# EAGLE design Detectors (EAGLE 9.4.2)
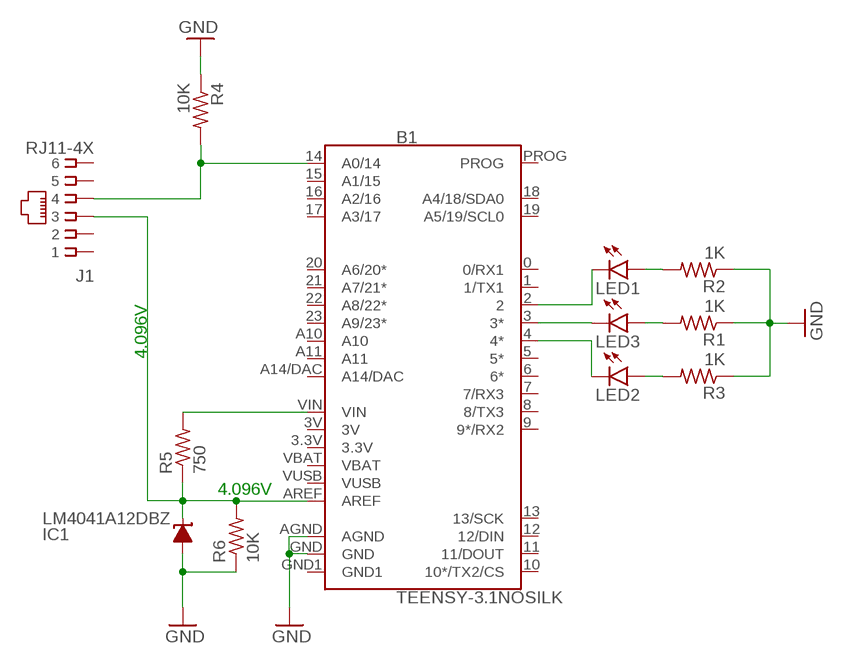
[diagram p0: schematic, sheet 1]

## Parts
B1  TEENSY-3.1NOSILK  [TEENSY-3.1_NOSILK]
IC1  LM4041A12DBZ  [DBZ_R-PDSO-G3]
J1  RJ11-4X  [RJ11-NO_SHIELD]
LED1  LED5MM  [LED5MM]
LED2  LED5MM  [LED5MM]
LED3  LED5MM  [LED5MM]
R1  1K  R-US_R0805  [R0805]
R2  1K  R-US_R0805  [R0805]
R3  1K  R-US_R0805  [R0805]
R4  10K  R-US_R0805  [R0805]
R5  750  R-US_R0805  [R0805]
R6  10K  R-US_R0805  [R0805]

## Nets
GND: B1.AGND B1.GND IC1.2(A) R1.1 R2.1 R3.1 R4.1 R6.1
N$1: B1.AREF IC1.1(C) J1.3 R5.1 R6.2
N$2: LED2.A R3.2
N$3: LED3.A R1.2
N$4: LED1.A R2.2
N$5: B1.2 LED1.K(C)
N$6: B1.3(3*) LED3.K(C)
N$7: B1.4(4*) LED2.K(C)
N$8: B1.VIN R5.2
N$9: B1.14(A0/14) J1.4 R4.2
Unconnected: B1.0(0/RX1) B1.1(1/TX1) B1.5(5*) B1.6(6*) B1.7(7/RX3) B1.8(8/TX3) B1.9(9*/RX2) B1.10(10*/TX2/CS) B1.11(11/DOUT) B1.12(12/DIN) B1.13(13/SCK) B1.15(A1/15) B1.16(A2/16) B1.17(A3/17) B1.18(A4/18/SDA0) B1.19(A5/19/SCL0) B1.20(A6/20*) B1.21(A7/21*) B1.22(A8/22*) B1.23(A9/23*) B1.A10 B1.A11 B1.A14/DAC B1.PROG J1.1 J1.2 J1.5 J1.6

## Notes on the sheet
- 4.096V
- 4.096V

## Power pins joined to a net without a drawn wire
3.3V: B1.3.3V
3V: B1.3V
GND1: B1.GND1
VBAT: B1.VBAT
VUSB: B1.VUSB

## Library data of the parts
B1 = SparkFun-Boards:TEENSY-3.1: Teensy 3+ Footprint Mechanical footprint with connectors for Teensy Development Board with ARM Cortex. SparkFun Products: Teensy 3.2 <https://www.sparkfun.com/products/13736> Teensy LC <https://www.sparkfun.com/products/13305>; SF_ID: DEV-12646
IC1 = texas:LM4041: PRECISION MICROPOWER SHUNT VOLTAGE REFERENCE Source: http://focus.ti.com/lit/ds/slcs146e/slcs146e.pdf; MPN: LM4041A12IDBZR; OC_FARNELL: 1407949; OC_NEWARK: 58K5875
J1 = con-tycoelectronics:RJ11: CORCOM Modular RJ Jacks No Shield Source: www.tycoelectronics.com .. ENG_DS_1654001_1099_RJ_L_0507.pdf; MPN: 6609214-3; OC_FARNELL: unknown; OC_NEWARK: 19R7022
LED1-LED3 = led:LED: LED OSRAM: - CHIPLED LG R971, LG N971, LY N971, LG Q971, LY Q971, LO R971, LY R971 LH N974, LH R974 LS Q976, LO Q976, LY Q976 LO Q996 - Hyper CHIPLED LW Q18S LB Q993, LB Q99A, LB R99A - SideLED LS A670, LO A670, LY A670, LG A670, LP A670 LB A673, LV A673, LT A673, LW A673 LH A674 LY A675 LS A676, LA A676, LO A676, LY A676, LW A676 LS A679, LY A679, LG A679 - Hyper Micro SIDELED® LS Y876, LA Y876, LO Y876, LY Y876 LT Y87S - SmartLED LW L88C, LW L88S LB L89C, LB L89S, LG L890 LS L89K, LO L89K, LY L89K LS L896, LA L896, LO L896, LY L896 - TOPLED LS T670, LO T670, LY T670, LG T670, LP T670 LSG T670, LSP T670, LSY T670, LOP T670, LYG T670 LG T671, LOG T671, LSG T671 LB T673, LV T673, LT T673, LW T673 LH T674 LS T676, LA T676, LO T676, LY T676, LB T676, LH T676, LSB T676, LW T676 LB T67C, LV T67C, LT T67C, LS T67K, LO T67K, LY T67K, LW E67C LS E67B, LA E67B, LO E67B, LY E67B, LB E67C, LV E67C, LT E67C LW T67C LS T679, LY T679, LG T679 LS T770, LO T770, LY T770, LG T770, LP T770 LB T773, LV T773, LT T773, LW T773 LH T774 LS E675, LA E675, LY E675, LS T675 LS T776, LA T776, LO T776, LY T776, LB T776 LHGB T686 LT T68C, LB T68C - Hyper Mini TOPLED® LB M676 - Mini TOPLED Santana® LG M470 LS M47K, LO M47K, LY M47K Source: http://www.osram.convergy.de LUXEON: - LUMILED® LXK2-PW12-R00, LXK2-PW12-S00, LXK2-PW14-U00, LXK2-PW14-V00 LXK2-PM12-R00, LXK2-PM12-S00, LXK2-PM14-U00 LXK2-PE12-Q00, LXK2-PE12-R00, LXK2-PE12-S00, LXK2-PE14-T00, LXK2-PE14-U00 LXK2-PB12-K00, LXK2-PB12-L00, LXK2-PB12-M00, LXK2-PB14-N00, LXK2-PB14-P00, LXK2-PB14-Q00 LXK2-PR12-L00, LXK2-PR12-M00, LXK2-PR14-Q00, LXK2-PR14-R00 LXK2-PD12-Q00, LXK2-PD12-R00, LXK2-PD12-S00 LXK2-PH12-R00, LXK2-PH12-S00 LXK2-PL12-P00, LXK2-PL12-Q00, LXK2-PL12-R00 Source: www.luxeon.com KINGBRIGHT: KA-3528ASYC Source: www.kingbright.com
R1-R6 = rcl:R-US_: RESISTOR, American symbol; SPICEPREFIX: R

## Board
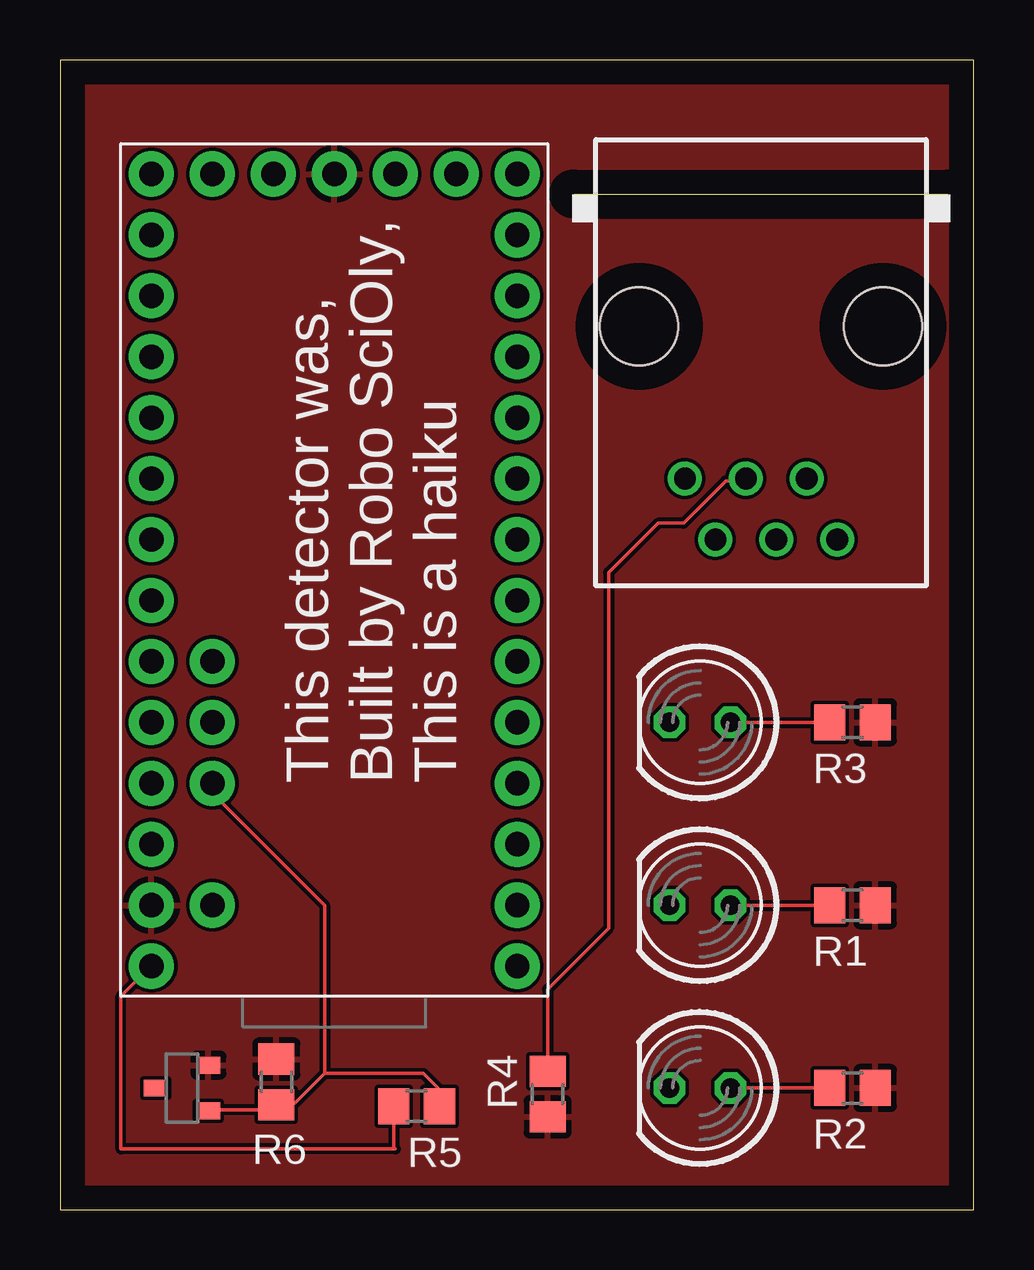
[diagram p1: board, top side]
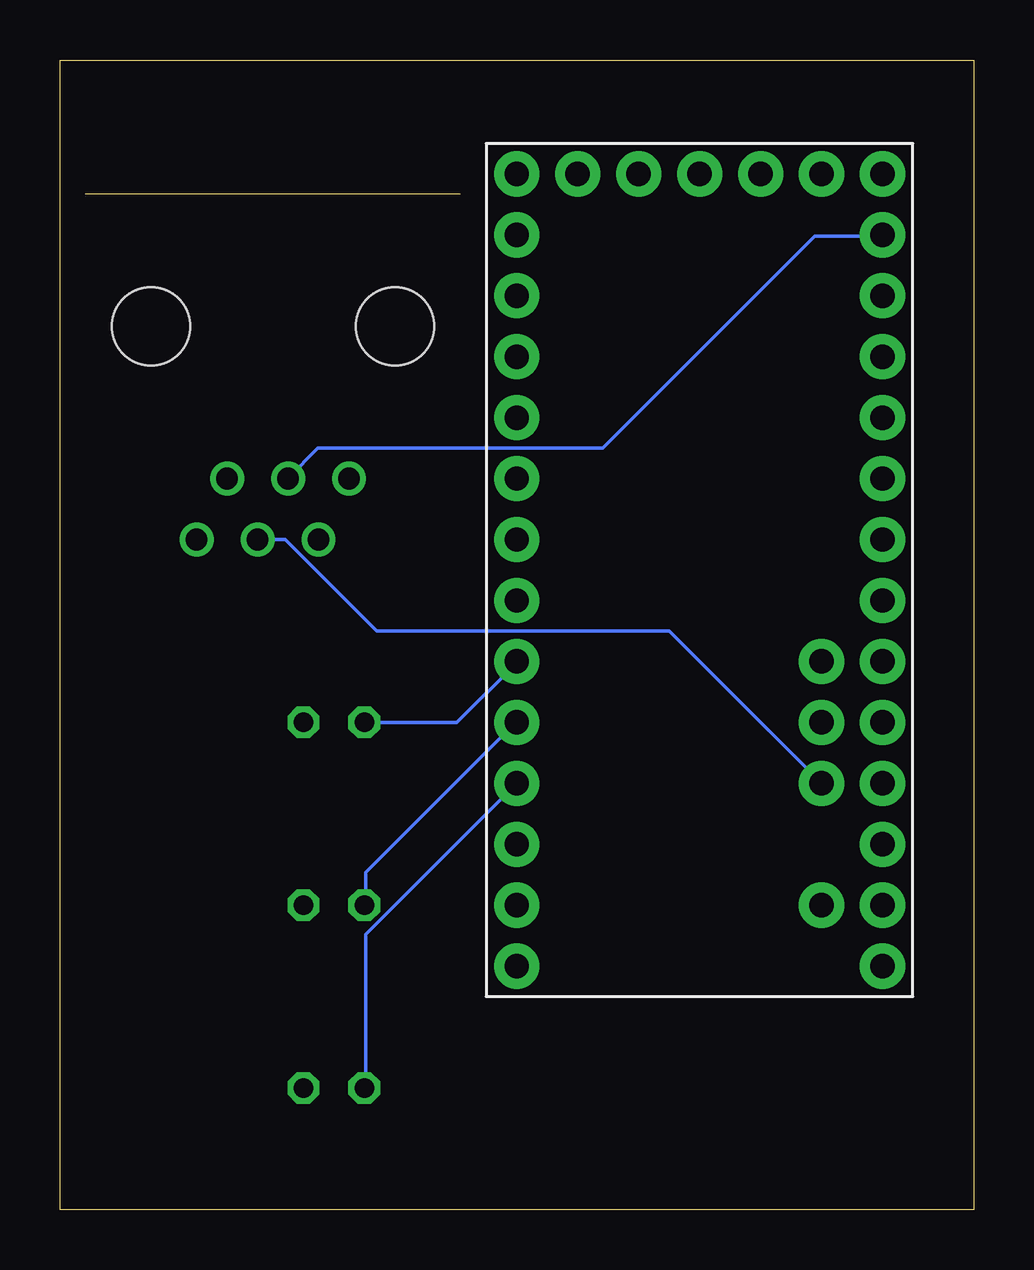
[diagram p2: board, bottom side, seen from below]

Size 38.08 x 47.93 mm. Coordinates in mm from the lower left corner, seen from the top.
Outline: 0,0 38.08,0 38.08,47.93 0,47.93 0,0
Copper layers (1*16): Top 0.035mm / dielectric 1.5mm / Bottom 0.035mm
Design rules "default": minimum track width 6mil, minimum drill 0.35mm, track to track 6mil, track to pad 6mil, pad to pad 6mil, via to via 6mil, smd to smd 6mil, copper to edge 40mil, drill to drill 6mil, minimum pad ring 10mil, minimum via ring 8mil, stop-mask expansion 4mil, vias tented up to drill 0mil, thermal gap 10mil

### Footprints (pad centres in the part's own frame; a part is rotated, then mirrored left to right if it is on the bottom)
TEENSY-3.1_NOSILK = drill 1.016 pad 1.88: 0 7.62,-13.97; 1 7.62,-11.43; 2 7.62,-8.89; 3 7.62,-6.35; 3.3V 2.54,16.51; 3V -7.62,-11.43; 4 7.62,-3.81; 5 7.62,-1.27; 6 7.62,1.27; 7 7.62,3.81; 8 7.62,6.35; 9 7.62,8.89; 10 7.62,11.43; 11 7.62,13.97; 12 7.62,16.51; 13 -7.62,16.51; 14 -7.62,13.97; 15 -7.62,11.43; 16 -7.62,8.89; 17 -7.62,6.35; 18 -7.62,3.81; 19 -7.62,1.27; 20 -7.62,-1.27; 21 -7.62,-3.81; 22 -7.62,-6.35; 23 -7.62,-8.89; A10 -5.08,-6.35; A11 -5.08,-3.81; A14/DAC -5.08,16.51; AGND -7.62,-13.97; AREF -5.08,-8.89; GND 0,16.51; GND1 7.62,-16.51; PROG -2.54,16.51; VBAT 5.08,16.51; VIN -7.62,-16.51; VUSB -5.08,-13.97
DBZ_R-PDSO-G3 = smd 0.7 x 1: 1 -0.95,-1.1; 2 0.95,-1.1; 3 0,1.1
RJ11-NO_SHIELD = drill 0.9 pad 1.4: 1 -3.175,8.89; 2 -1.905,6.35; 3 -0.635,8.89; 4 0.635,6.35; 5 1.905,8.89; 6 3.175,6.35 | hole 3.251: -5.08,0; 5.08,0
LED5MM = drill 0.813 octagon: A -1.27,0; K 1.27,0
R0805 = smd 1.3 x 1.5: 1 -0.95,0; 2 0.95,0

### Placement (x,y rotation side)
B1  11.43,26.67 0 top
IC1  5.08,5.08 90 top
J1  29.21,36.83 180 top
LED1  26.67,5.08 180 top
LED2  26.67,20.32 180 top
LED3  26.67,12.7 180 top
R1  33.02,12.7 180 top
R2  33.02,5.08 180 top
R3  33.02,20.32 180 top
R4  20.32,4.83 90 top
R5  14.86,4.32 180 top
R6  9.02,5.33 270 top

### Tracks (layer width: path | path; a pad name or v marks a point on that pad's centre or on a via)
GND
  pour Top: -2.54,49.53 39.37,49.53 40.64,48.26 40.64,0 -3.81,0 -2.54,1.27
N$1
  Top 0.152: IC1.1 6.3,4.17 8.74,4.17 8.89,4.32 R6.2 9.04,4.47 9.8,4.47 11.02,5.69 | 11.02,5.69 15.14,5.69 15.75,5.08 15.75,4.32 R5.1 | 11.02,5.69 11.02,12.7 6.45,17.27 6.45,17.73 B1.AREF
  Bottom 0.152: J1.3 28.7,27.94 24.89,24.13 12.7,24.13 B1.AREF
N$2
  Top 0.152: LED2.A R3.2
N$3
  Top 0.152: LED3.A R1.2
N$4
  Top 0.152: LED1.A R2.2
N$5
  Bottom 0.152: B1.2 25.35,11.48 25.35,5.08 LED1.K
N$6
  Bottom 0.152: LED3.K 25.35,12.7 25.35,14.07 19.1,20.32 B1.3
N$7
  Bottom 0.152: LED2.K 21.54,20.32 19.1,22.76 B1.4
N$8
  Top 0.152: R5.2 13.91,2.6 13.97,2.54 2.54,2.54 2.54,8.89 B1.VIN
N$9
  Top 0.152: R4.2 20.32,9.2 22.86,11.73 22.86,26.57 24.92,28.63 25.98,28.63 27.74,30.38 28.55,30.38 J1.4
  Bottom 0.152: B1.14 3.86,40.59 6.63,40.59 15.47,31.75 27.33,31.75 28.55,30.53 J1.4

### Text on the board
tPlace: This detector was, / Built by Robo SciOly, / This is a haiku